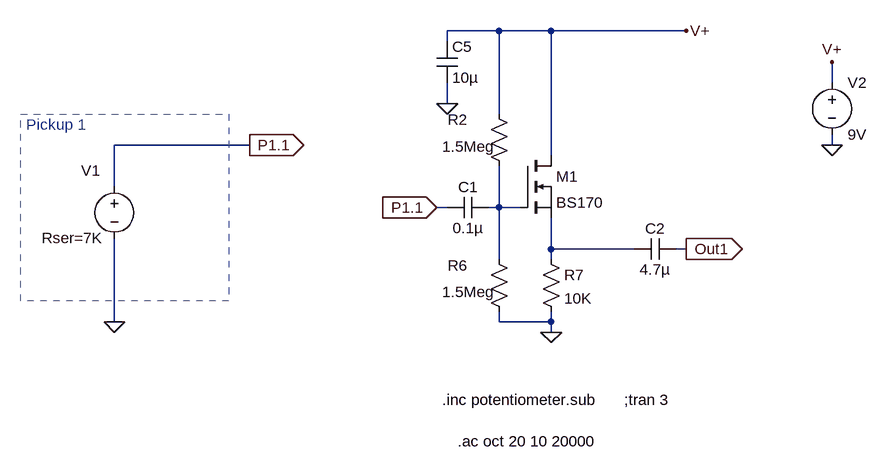
[diagram p0: schematic buffer-mosfet.asc]
buffer-mosfet.asc, the LTspice schematic file:
Version 4
SHEET 1 880 680
WIRE -1200 -880 -1280 -880
WIRE -1120 -880 -1200 -880
WIRE -912 -880 -1120 -880
WIRE -1280 -864 -1280 -880
WIRE -688 -800 -688 -832
WIRE -1280 -768 -1280 -800
WIRE -1200 -752 -1200 -880
WIRE -1584 -704 -1792 -704
WIRE -688 -704 -688 -720
WIRE -1120 -688 -1120 -880
WIRE -1792 -640 -1792 -704
WIRE -1280 -608 -1296 -608
WIRE -1200 -608 -1200 -672
WIRE -1200 -608 -1216 -608
WIRE -1168 -608 -1200 -608
WIRE -1120 -544 -1120 -592
WIRE -992 -544 -1120 -544
WIRE -912 -544 -928 -544
WIRE -1200 -528 -1200 -608
WIRE -1120 -528 -1120 -544
WIRE -1792 -432 -1792 -560
WIRE -1200 -432 -1200 -448
WIRE -1120 -432 -1120 -448
WIRE -1120 -432 -1200 -432
WIRE -1120 -416 -1120 -432
FLAG -1792 -432 0
FLAG -688 -704 0
FLAG -688 -832 V+
FLAG -1584 -704 P1.1
IOPIN -1584 -704 Out
FLAG -1296 -608 P1.1
IOPIN -1296 -608 In
FLAG -1120 -416 0
FLAG -912 -880 V+
FLAG -912 -544 Out1
IOPIN -912 -544 Out
FLAG -1280 -768 0
SYMBOL cap -1216 -624 R90
WINDOW 0 0 32 VBottom 2
WINDOW 3 32 32 VTop 2
SYMATTR InstName C1
SYMATTR Value 0.1µ
SYMBOL voltage -1792 -656 R0
WINDOW 39 -112 95 Left 2
WINDOW 3 24 96 Invisible 2
WINDOW 0 -51 -9 Left 2
SYMATTR SpiceLine Rser=7K
SYMATTR Value SINE(0 0.1V 10000)
SYMATTR InstName V1
SYMATTR Value2 AC 1
SYMBOL voltage -688 -816 R0
WINDOW 123 0 0 Left 2
WINDOW 39 0 0 Left 2
SYMATTR InstName V2
SYMATTR Value 9V
SYMBOL res -1216 -544 R0
WINDOW 0 -63 25 Left 2
WINDOW 3 -72 66 Left 2
SYMATTR InstName R6
SYMATTR Value 1.5Meg
SYMBOL res -1136 -544 R0
SYMATTR InstName R7
SYMATTR Value 10K
SYMBOL cap -928 -560 R90
WINDOW 0 0 32 VBottom 2
WINDOW 3 32 32 VTop 2
SYMATTR InstName C2
SYMATTR Value 4.7µ
SYMBOL cap -1296 -864 R0
SYMATTR InstName C5
SYMATTR Value 10µ
SYMBOL res -1216 -768 R0
WINDOW 0 -63 25 Left 2
WINDOW 3 -72 66 Left 2
SYMATTR InstName R2
SYMATTR Value 1.5Meg
SYMBOL nmos -1168 -688 R0
SYMATTR InstName M1
SYMATTR Value BS170
TEXT -1008 -312 Left 2 !;tran 3
TEXT -1264 -248 Left 2 !.ac oct 20 10 20000
TEXT -1288 -312 Left 2 !.inc potentiometer.sub
TEXT -1928 -736 Left 2 ;Pickup 1
RECTANGLE Normal -1616 -464 -1936 -752 2

The netlist it stands for:
* buffer-mosfet.asc
C1 N001 P1.1 0.1µ
V1 P1.1 0 SINE(0 0.1V 10000) AC 1 Rser=7K
V2 V+ 0 9V
R6 N001 0 1.5Meg
R7 N002 0 10K
C2 Out1 N002 4.7µ
C5 V+ 0 10µ
R2 V+ N001 1.5Meg
M1 V+ N001 N002 N002 BS170
.model NMOS NMOS
.model PMOS PMOS
.lib standard.mos
;tran 3
.ac oct 20 10 20000
.inc potentiometer.sub
* Pickup 1
.backanno
.end